# Altium schematic sheet Sheet1.SchDoc
size A3; SheetNumber: 1; SheetTotal: 1
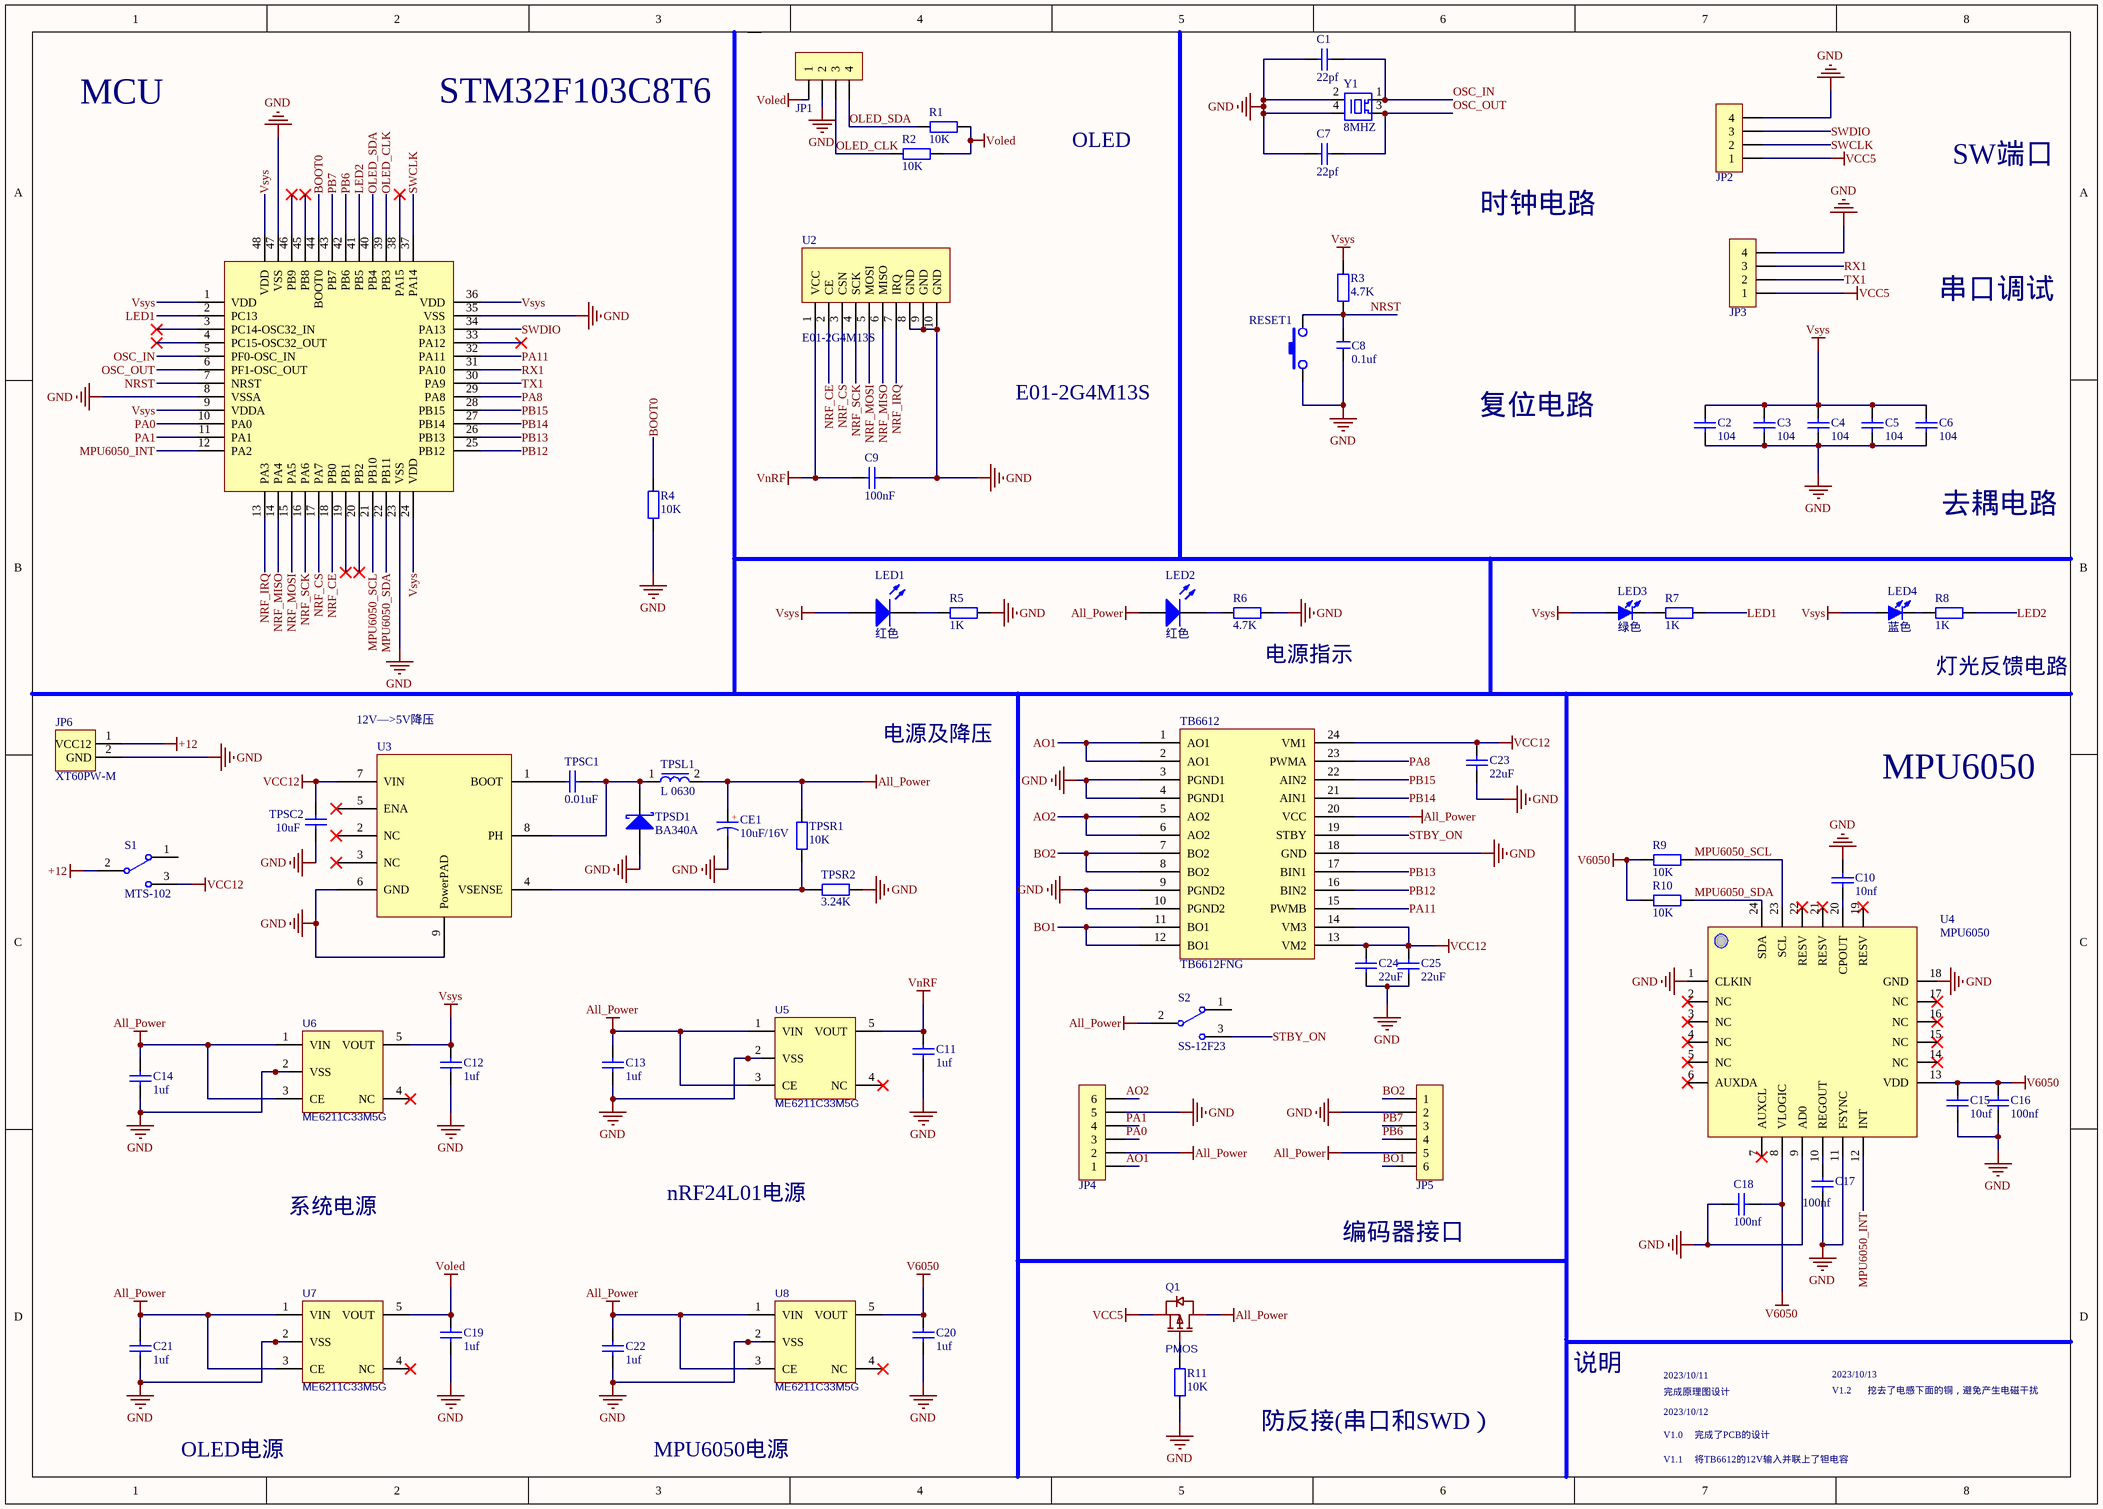
[diagram p0: Sheet1.SchDoc]

## Parts
C1  22pf  [C0603_M]
C2  104  [C0603_M]
C3  104  [C0603_M]
C4  104  [C0603_M]
C5  104  [C0603_M]
C6  104  [C0603_M]
C7  22pf  [C0603_M]
C8  0.1uf  [C0603_M]
C9  100nF  [C0603_M]
C10  10nf  [C0603_M]
C11  1uf  [C0603_M]
C12  1uf  [C0603_M]
C13  1uf  [C0603_M]
C14  1uf  [C0603_M]
C15  10uf  [C0603_M]
C16  100nf  [C0603_M]
C17  100nf  [C0603_M]
C18  100nf  [C0603_M]
C19  1uf  [C0603_M]
C20  1uf  [C0603_M]
C21  1uf  [C0603_M]
C22  1uf  [C0603_M]
C23  22uF  [C_3216]
C24  22uF  [C0603_M]
C25  22uF  [C0603_M]
CE1  10uF/16V  [CE-3.5*8*11.5 - BK - duplicate]
JP1  HDR-1X4  [HDR2.54-M-LI-4P]  (value not drawn)
JP2  HDR-1X4  [HDR2.54-M-LI-4P]  (value not drawn)
JP3  HDR-1X4  [HDR2.54-M-LI-4P]  (value not drawn)
JP4  HDR-1X6  [XH2.54-LI-6P]  (value not drawn)
JP5  HDR-1X6  [XH2.54-LI-6P]  (value not drawn)
JP6  XT60PW-M  [XT60PW-M]
LED1  红色  [LED0805_B]
LED2  红色  [LED0805_B]
LED3  绿色  [LED0805_B]
LED4  蓝色  [LED0805_R]
MCU  STM32F103C8T6  [STM-LQFP48_N]
Q1  PMOS  [SOT23]
R1  10K  [R0603_M]
R2  10K  [R0603_M]
R3  4.7K  [R0603_M]
R4  10K  [R0603_M]
R5  1K  [R0603_M]
R6  4.7K  [R0603_M]
R7  1K  [R0603_M]
R8  1K  [R0603_M]
R9  10K  [R0603_M]
R10  10K  [R0603_M]
R11  10K  [R0603_M]
RESET1  KEY  [SW SMD-3*6*5]  (value not drawn)
S1  MTS-102  [MTS-10x]
S2  SS-12F23  [SS-12D0703]
TB6612  TB6612FNG  [SSOP-24_L8.3-W5.6-P0.65-LS7.6-BL]
TPSC1  0.01uF  [C0603_M]
TPSC2  10uF  [C0603_M]
TPSD1  BA340A  [SMA]
TPSL1  L 0630  [L 0630]
TPSR1  10K  [R0603_M]
TPSR2  3.24K  [R0603_M]
U2  E01-2G4M13S  [E01-2G4M01S1B]
U3  TPS5430DDAR  [TPS5430DAR]  (value not drawn)
U4  MPU6050  [QFN24 4x4_M]
U5  ME6211C33M5G  [SOT-23-5]
U6  ME6211C33M5G  [SOT-23-5]
U7  ME6211C33M5G  [SOT-23-5]
U8  ME6211C33M5G  [SOT-23-5]
Y1  8MHZ  [3225]

## Nets
+12: JP6.1(VCC12) S1.2
All_Power: C13.2 C14.2 C21.2 C22.2 CE1.1 JP4.2 JP5.5 LED2.1(A) Q1.3(D) S2.2 TB6612.20(VCC) TPSL1.2 TPSR1.2 U5.1(VIN) U5.3(CE) U6.1(VIN) U6.3(CE) U7.1(VIN) U7.3(CE) U8.1(VIN) U8.3(CE)
GND: C1.1 C2.1 C3.1 C4.1 C5.1 C6.1 C7.1 C8.2 C9.2 C10.2 C11.1 C12.1 C13.1 C14.1 C15.1 C16.1 C17.1 C18.1 C19.1 C20.1 C21.1 C22.1 C23.2 C24.1 C25.1 CE1.2 JP1.2 JP2.4 JP3.4 JP4.5 JP5.2 JP6.2(GND) MCU.8(VSSA) MCU.23(VSS) MCU.35(VSS) MCU.47(VSS) R4.2 R5.2 R6.1 R11.1 RESET1.1 TB6612.3(PGND1) TB6612.4(PGND1) TB6612.9(PGND2) TB6612.10(PGND2) TB6612.18(GND) TPSC2.1 TPSD1.1(A) TPSR2.1 U2.8(GND) U2.9(GND) U2.10(GND) U3.6(GND) U3.9(PowerPAD) U4.1(CLKIN) U4.9(AD0) U4.11(FSYNC) U4.18(GND) U5.2(VSS) U6.2(VSS) U7.2(VSS) U8.2(VSS) Y1.2(GND) Y1.4(GND)
V6050: C15.2 C16.2 C18.2 C20.2 R9.1 R10.1 U4.8(VLOGIC) U4.13(VDD) U8.5(VOUT)
VCC5: JP2.1 JP3.1 Q1.2(S)
VCC12: C23.1 C24.2 C25.2 S1.3 TB6612.13(VM2) TB6612.14(VM3) TB6612.24(VM1) TPSC2.2 U3.7(VIN)
VnRF: C9.1 C11.2 U2.1(VCC) U5.5(VOUT)
Voled: C19.2 JP1.1 R1.2 R2.2 U7.5(VOUT)
Vsys: C2.2 C3.2 C4.2 C5.2 C6.2 C12.2 LED1.1(A) LED3.1(A) LED4.1(A) MCU.1(VDD) MCU.9(VDDA) MCU.24(VDD) MCU.36(VDD) MCU.48(VDD) R3.2 U6.5(VOUT)
AO1: JP4.1 TB6612.1(AO1) TB6612.2(AO1)
AO2: JP4.6 TB6612.5(AO2) TB6612.6(AO2)
BO1: JP5.6 TB6612.11(BO1) TB6612.12(BO1)
BO2: JP5.1 TB6612.7(BO2) TB6612.8(BO2)
BOOT0: MCU.44(BOOT0) R4.1
LED1: MCU.2(PC13) R7.2
LED2: MCU.41(PB5) R8.2
MPU6050_INT: MCU.12(PA2) U4.12(INT)
MPU6050_SCL: MCU.21(PB10) R9.2 U4.23(SCL)
MPU6050_SDA: MCU.22(PB11) R10.2 U4.24(SDA)
NRF_CE: MCU.18(PB0) U2.2(CE)
NRF_CS: MCU.17(PA7) U2.3(CSN)
NRF_IRQ: MCU.13(PA3) U2.7(IRQ)
NRF_MISO: MCU.14(PA4) U2.6(MISO)
NRF_MOSI: MCU.15(PA5) U2.5(MOSI)
NRF_SCK: MCU.16(PA6) U2.4(SCK)
NRST: C8.1 MCU.7(NRST) R3.1 RESET1.2
OLED_CLK: JP1.3 MCU.39(PB3) R2.1
OLED_SDA: JP1.4 MCU.40(PB4) R1.1
OSC_IN: C1.2 MCU.5(PF0-OSC_IN) Y1.1(XTAL1)
OSC_OUT: C7.2 MCU.6(PF1-OSC_OUT) Y1.3(XTAL3)
PA0: JP4.3 MCU.10(PA0)
PA1: JP4.4 MCU.11(PA1)
PA8: MCU.29(PA8) TB6612.23(PWMA)
PA11: MCU.32(PA11) TB6612.15(PWMB)
PB6: JP5.4 MCU.42(PB6)
PB7: JP5.3 MCU.43(PB7)
PB12: MCU.25(PB12) TB6612.16(BIN2)
PB13: MCU.26(PB13) TB6612.17(BIN1)
PB14: MCU.27(PB14) TB6612.21(AIN1)
PB15: MCU.28(PB15) TB6612.22(AIN2)
RX1: JP3.3 MCU.31(PA10)
STBY_ON: S2.3 TB6612.19(STBY)
SWCLK: JP2.2 MCU.37(PA14)
SWDIO: JP2.3 MCU.34(PA13)
TX1: JP3.2 MCU.30(PA9)
NetC10_1: C10.1 U4.20(CPOUT)
NetC17_2: C17.2 U4.10(REGOUT)
NetLED1_2: LED1.2(K) R5.1
NetLED2_2: LED2.2(K) R6.2
NetLED3_2: LED3.2(K) R7.1
NetLED4_2: LED4.2(K) R8.1
NetQ1_1: Q1.1(G) R11.2
NetTPSC1_1: TPSC1.1 TPSD1.2(K) TPSL1.1 U3.8(PH)
NetTPSC1_2: TPSC1.2 U3.1(BOOT)
NetTPSR1_1: TPSR1.1 TPSR2.2 U3.4(VSENSE)

Not connected (* = marked no-connect by the designer): MCU 3(PC14-OSC32_IN)* 4(PC15-OSC32_OUT)* 19(PB1)* 20(PB2)* 33(PA12)* 38(PA15)* 45(PB8)* 46(PB9)*; S1 1; S2 1; U3 2(NC)* 3(NC)* 5(ENA)*; U4 2(NC)* 3(NC)* 4(NC)* 5(NC)* 6(AUXDA)* 7(AUXCL)* 14(NC)* 15(NC)* 16(NC)* 17(NC)* 19(RESV)* 21(RESV)* 22(RESV)*; U5 4(NC)*; U6 4(NC)*; U7 4(NC)*; U8 4(NC)*

## Notes on the sheet
- OLED
- SW端口
- 时钟电路
- 串口调试
- E01-2G4M13S
- 复位电路
- 去耦电路
- 12V—>5V降压
- (near R6) 电源指示
- 灯光反馈电路
- 电源及降压
- MPU6050
- 系统电源
- nRF24L01电源
- 编码器接口
- 说明
- 2023/10/11
- 完成原理图设计
- 2023/10/13
- V1.2
- 挖去了电感下面的铜，避免产生电磁干扰
- OLED电源
- MPU6050电源
- 防反接(串口和SWD）
- 2023/10/12
- V1.0
- V1.1
- 完成了PCB的设计
- 将TB6612的12V输入并联上了钽电容
- (in symbol CE) +

## Library data of the parts
C1 C7 C9 TPSC1 TPSC2 = C: 贴片电容; BOM名称: 无极性贴片电容; 联系卖家，免费查找封装: 唯一出售店铺网址https://shop463601444.taobao.com
C2-C6 C23-C25 = C: 贴片电容/MLCC电容; BOM名称: 无极性贴片电容; 当前库版本V2022.11.14 @淘宝卖家:黄晶宝石: 最新版本发布https://shop463601444.taobao.com
C8 = C: 无极性贴片电容; 版权归属: 源创客; BOM名称: 无极性贴片电容; 学习资源: www.ooocke.com
C10 C15-C18 = C_1: 贴片电容; BOM名称: 无极性贴片电容; 联系卖家，免费查找封装: 唯一出售店铺网址https://shop463601444.taobao.com
C11-C14 C19-C22 = C_3: 贴片电容; BOM名称: 无极性贴片电容; 联系卖家，免费查找封装: 唯一出售店铺网址https://shop463601444.taobao.com
CE1 = CE: 直插电解电容; 联系卖家，免费查找封装: 唯一出售店铺网址https://shop463601444.taobao.com; BOM名称: 直插电解电容
JP1-JP3 = Header 4: 4P接插件; 封装库来自淘宝卖家 ID：黄晶宝石: 其他店铺购入均为盗版假冒封装库; 联系卖家，免费查找封装: 唯一出售店铺网址https://shop463601444.taobao.com; BOM名称: 4P接插件
JP4 JP5 = Header 6: 6P接插件; 联系卖家，免费查找封装: 唯一出售店铺网址https://shop463601444.taobao.com; 封装库来自淘宝卖家ID：黄晶宝石: 其他店铺购入均为盗版封装库，请立即申请退款，本店现金奖励50~200元; BOM名称: 6P接插件
JP6 = XT60PW: XT60PW-M弯插
LED1 LED2 = LED: 贴片LED; 封装库来自淘宝卖家：黄晶宝石: 其他店铺购入均为盗版封装库，无更新权益，请立即申请退款，本店现金奖励200~1000元; BOM名称: 贴片LED
LED3 LED4 = LED-SMD: 贴片LED; 联系卖家 免费查找封装: 封装库来自淘宝卖家ID：黄晶宝石; BOM名称: 贴片LED
MCU = STM32_LQFP48
Q1 = PMOS: BOM_Manufacturer: TWGMC; BOM_Manufacturer Part: AO3401; Contributor: LCSC; BOM_Supplier: LCSC; BOM_Supplier Part: C727156; BOM_JLCPCB Part Class: Extended Part; spicePre: Q; spiceSymbolName: AO3401_C727156
R1 R2 = R_1: 贴片电阻; 联系卖家，免费查找封装: 唯一出售店铺网址https://shop463601444.taobao.com; BOM名称: 贴片电阻
R3 = R: 贴片电阻; 版权归属: 源创客; BOM名称: 贴片电阻; 学习资源: www.ooocke.com
R4-R11 TPSR1 TPSR2 = R: 贴片电阻; 联系卖家，免费查找封装: 唯一出售店铺网址https://shop463601444.taobao.com; BOM名称: 贴片电阻
S1 = MTS-10x: MTS10x系列3脚扭子开关; 版权归属: 源创客; BOM名称: MTS10x系列3脚扭子开关; 学习资源: www.ooocke.com
S2 = SSW-1P: 1路波动开关; BOM名称: 波动开关; 版权归属: 源创客; 学习资源: www.ooocke.com
TPSD1 = SS210: 肖特基二极管; 联系卖家，免费查找封装: 唯一出售店铺网址https://shop463601444.taobao.com; BOM名称: 肖特基二极管
TPSL1 = L 0630: SMA
U2 = E01-2G4M13S: 贴片NREF24L01
U3 = TPS5430DDAR: 输出额定电流3A 纹波30mV
U4 = MPU6050: 9轴运动处理传感器
U5-U8 = ME6211C33: LDO 3.3V/0.5A; BOM名称: RT9193-30GB; 当前库版本V2022.11.14 @淘宝卖家:黄晶宝石: 最新版本发布https://shop463601444.taobao.com
Y1 = jinzheng